# EAGLE design untitled (EAGLE 9.6.2)
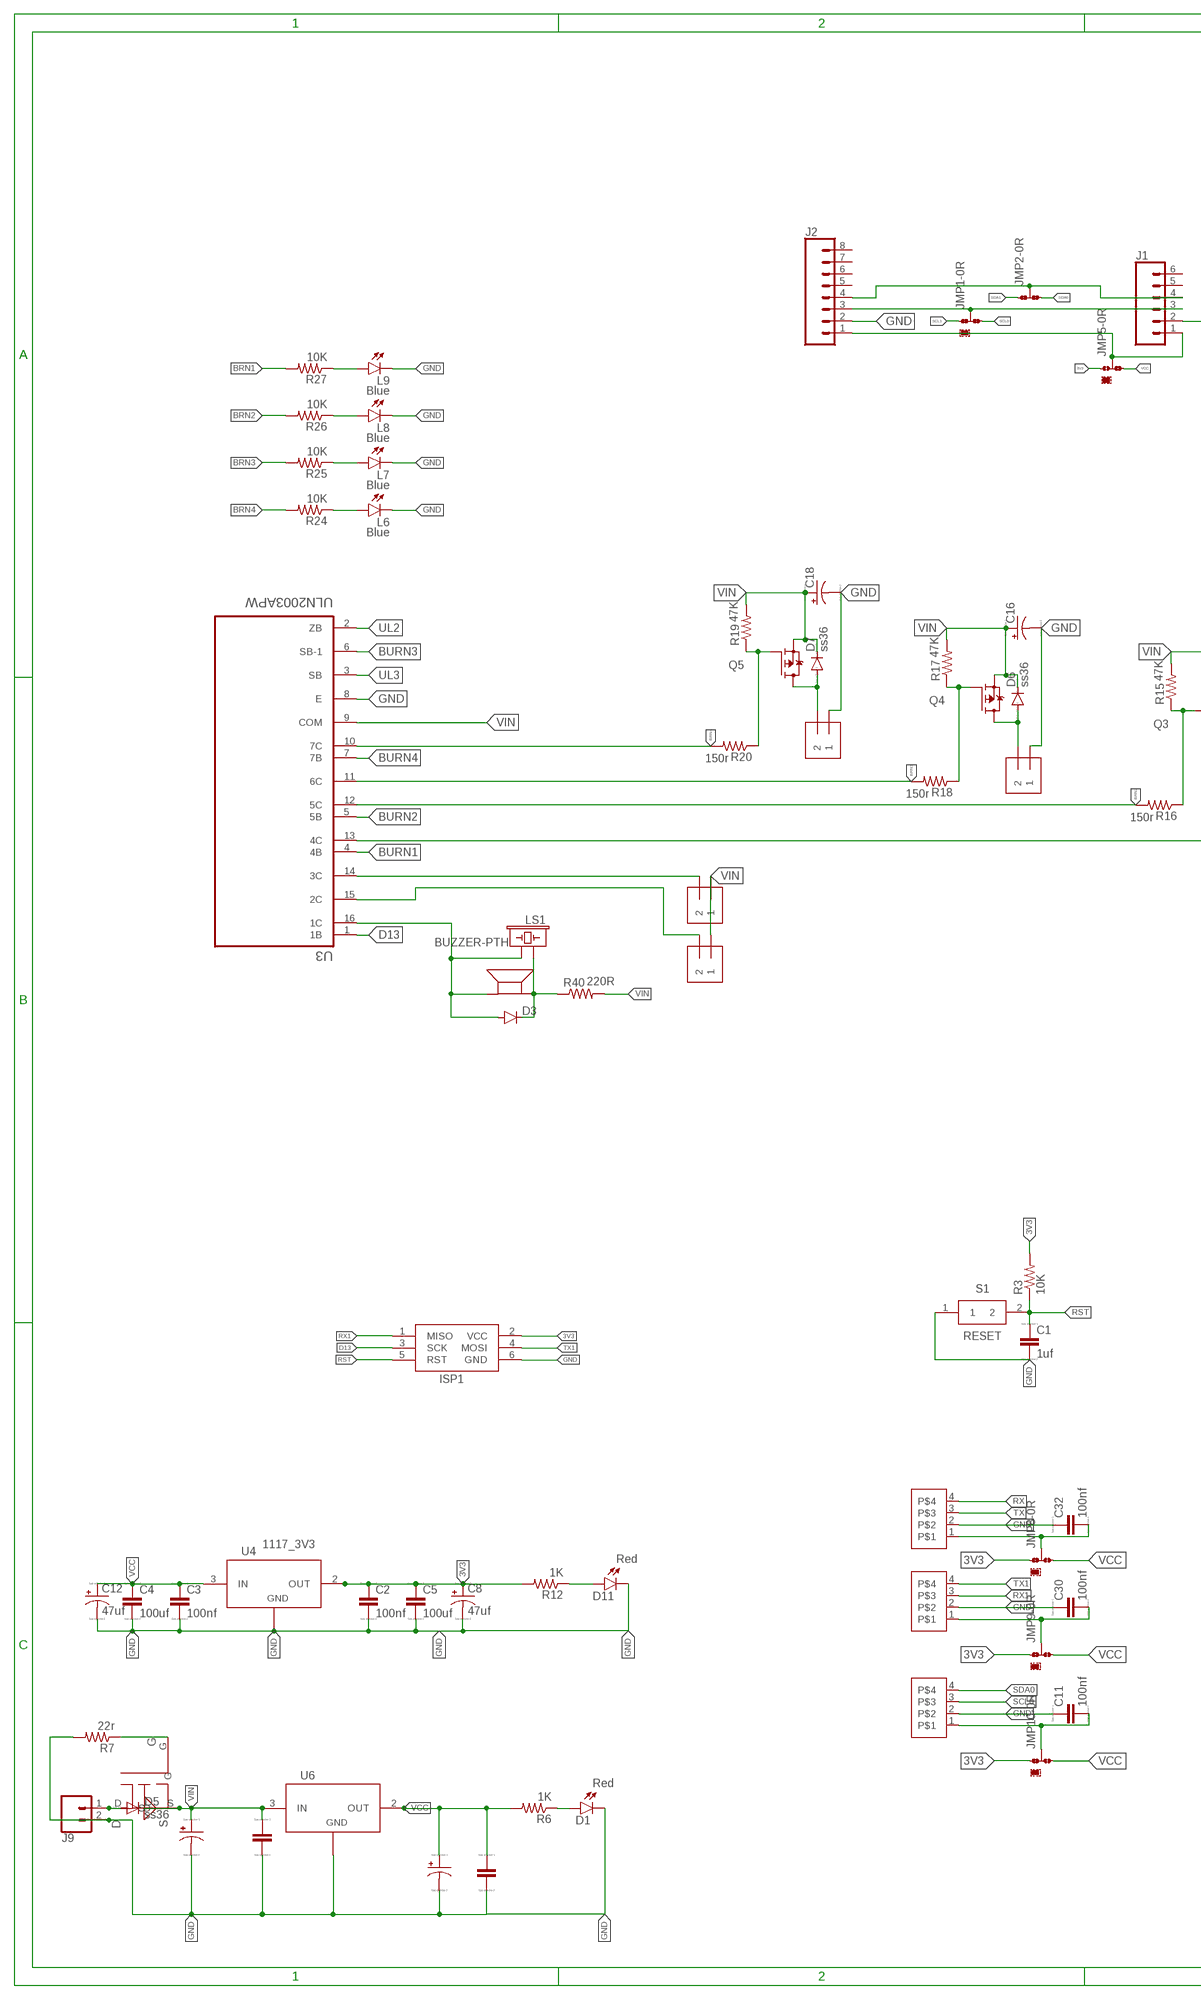
[diagram p0: schematic, sheet 1, part 1 of 2]
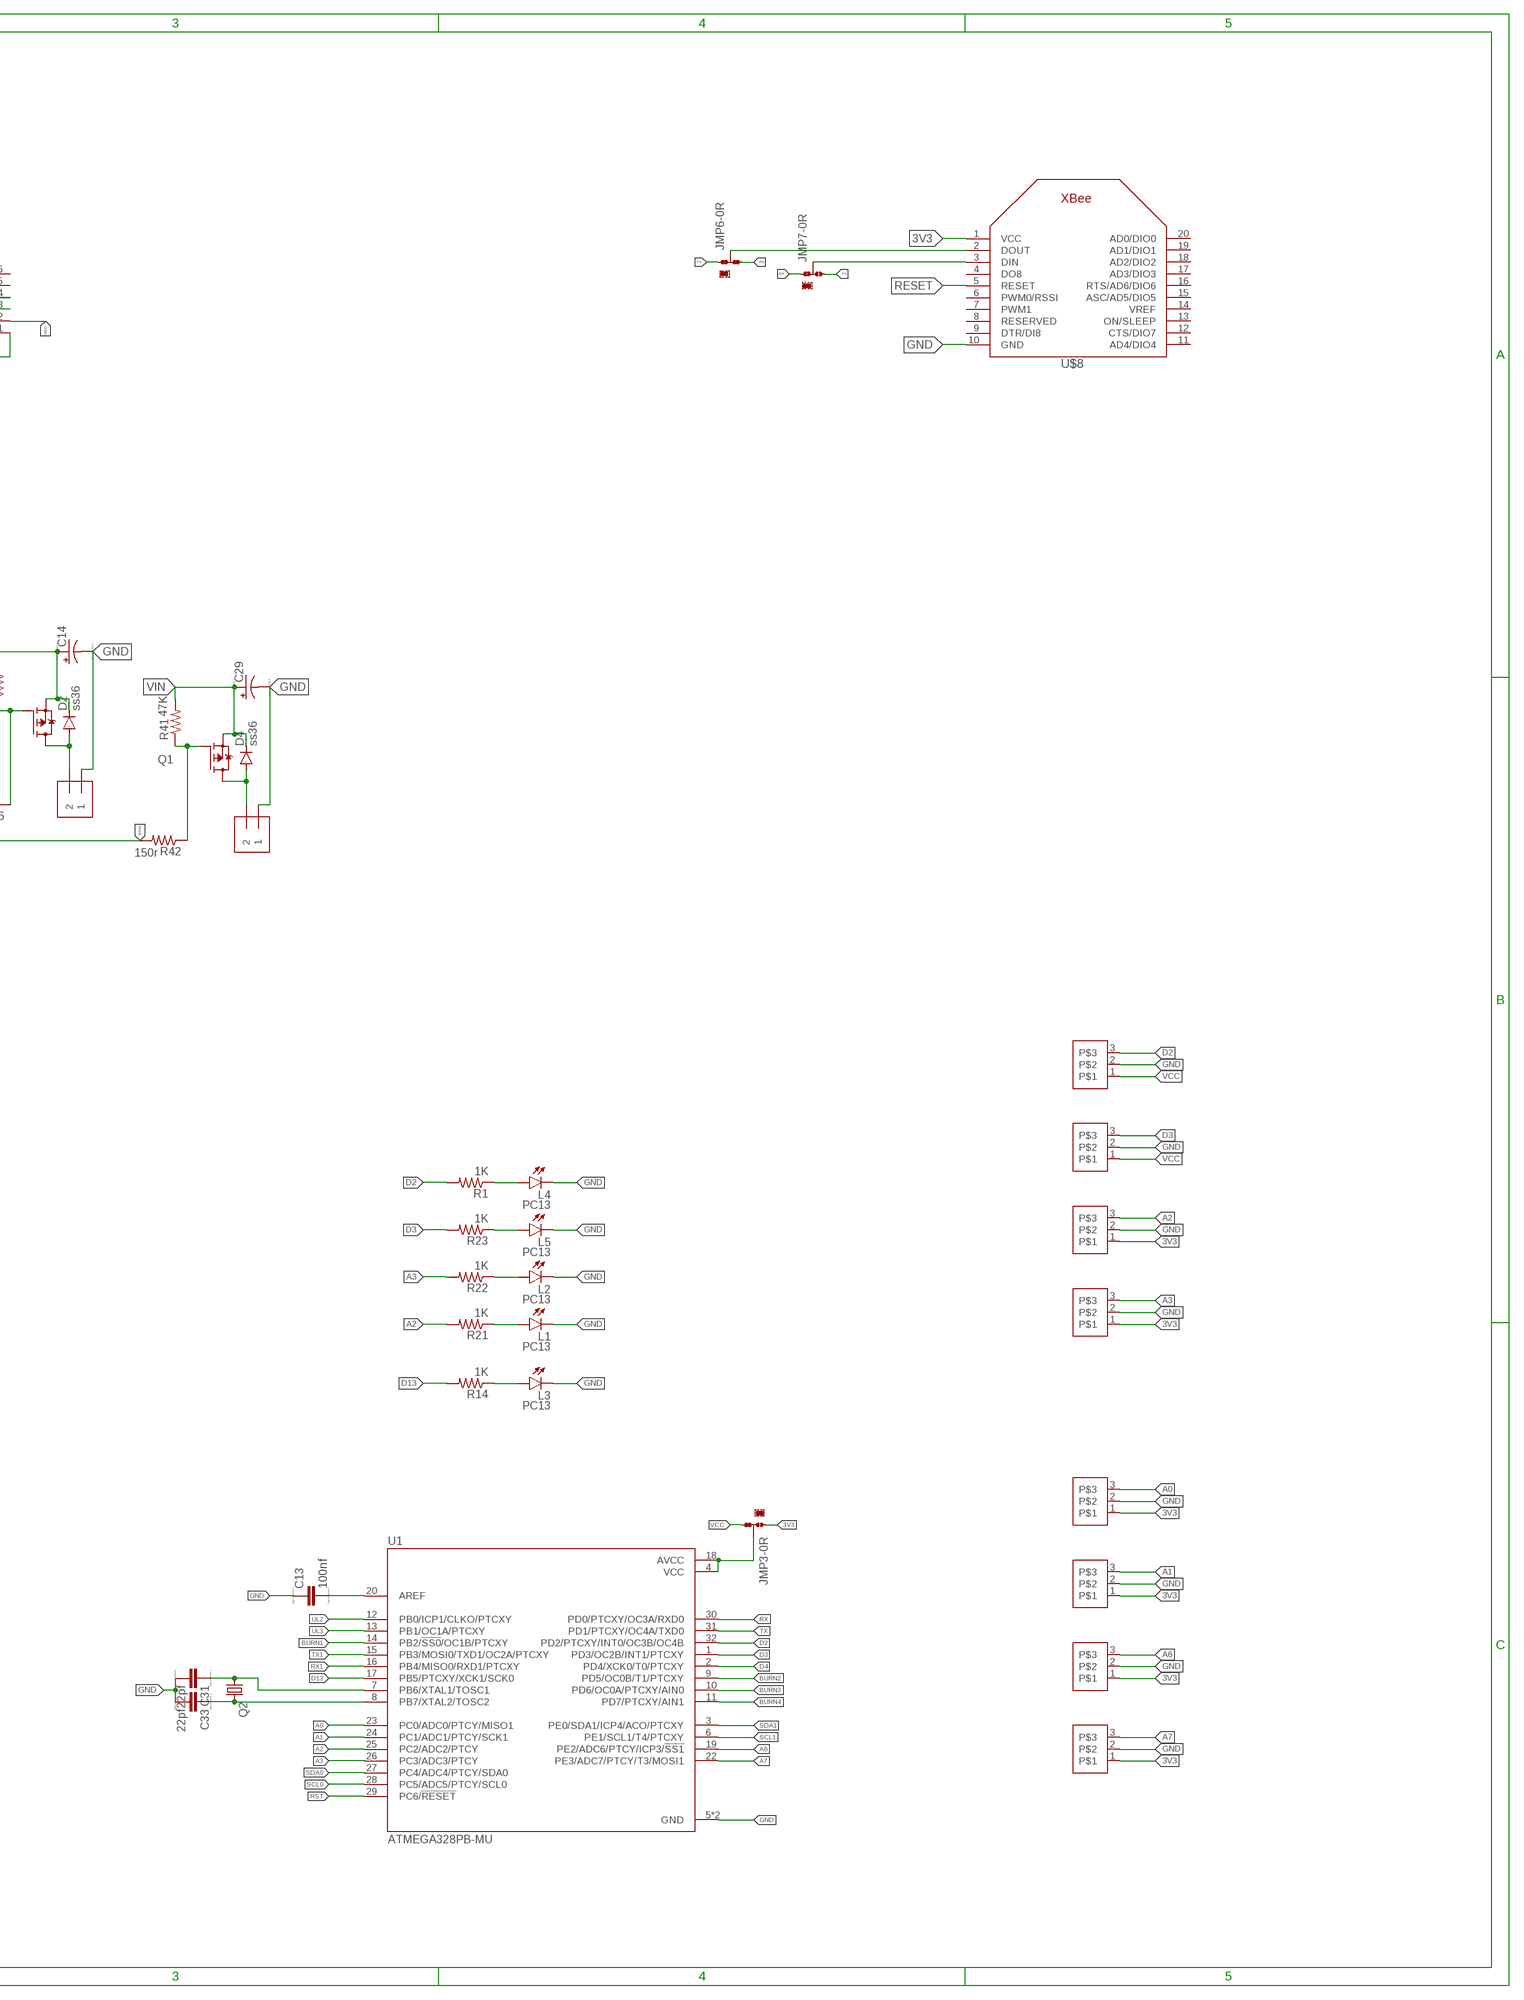
[diagram p1: schematic, sheet 1, part 2 of 2]

## Parts
C1  1uf  CAPACITOR_CER4  [C0603]
C2  100nf  CAPACITOR_CER4  [C0603]
C3  100nf  CAPACITOR_CER4  [C0603]
C4  100uf  CAPACITOR_CER9  [C1210]
C5  100uf  CAPACITOR_CER9  [C1210]
C6  100nf  CAPACITOR_CER4  [C0603]
C7  100uf  CAPACITOR_POLD  [PANASONIC_D]
C8  47uf  CAPACITOR_POLC  [PANASONIC_C]
C9  100nf  CAPACITOR_CER4  [C0603]
C10  100uf  CAPACITOR_POLD  [PANASONIC_D]
C11  100nf  CAPACITOR_CER4  [C0603]
C12  47uf  CAPACITOR_POLC  [PANASONIC_C]
C13  100nf  CAPACITOR_CER4  [C0603]
C14  CAPACITOR_POLC  [PANASONIC_C]
C16  CAPACITOR_POLC  [PANASONIC_C]
C18  CAPACITOR_POLC  [PANASONIC_C]
C29  CAPACITOR_POLC  [PANASONIC_C]
C30  100nf  CAPACITOR_CER4  [C0603]
C31  22pf  CAPACITOR_CER4  [C0603]
C32  100nf  CAPACITOR_CER4  [C0603]
C33  22pf  CAPACITOR_CER4  [C0603]
D1  Red  LED0603_R  [0603_LED_GREEN]
D2  ss36  DIODEAC2  [DO-214AC]
D3  DIODESOD  [SOD-323]
D4  ss36  DIODEAC2  [DO-214AC]
D5  ss36  DIODEAC2  [DO-214AC]
D6  ss36  DIODEAC2  [DO-214AC]
D7  ss36  DIODEAC2  [DO-214AC]
D11  Red  LED0603_R  [0603_LED_GREEN]
ISP1  AVRISP-6  [AVRISP]
J1  CONN_06NO_SILK_NO_POP  [1X06_NO_SILK]
J2  CONN_08NO_SILK_FEMALE_PTH  [1X08_NO_SILK]
J9  CONN_025MM  [SCREWTERMINAL-5MM-2]
JMP1  0R-JUMPA  [A0R-JMP]
JMP2  0R-JUMPA  [A0R-JMP]
JMP3  0R-JUMPA  [A0R-JMP]
JMP5  0R-JUMPA  [A0R-JMP]
JMP6  0R-JUMPA  [A0R-JMP]
JMP7  0R-JUMPA  [A0R-JMP]
JMP8  0R-JUMPA  [A0R-JMP]
JMP9  0R-JUMPA  [A0R-JMP]
JMP10  0R-JUMPA  [A0R-JMP]
L1  PC13  LED0603_R  [0603_LED_GREEN]
L2  PC13  LED0603_R  [0603_LED_GREEN]
L3  PC13  LED0603_R  [0603_LED_GREEN]
L4  PC13  LED0603_R  [0603_LED_GREEN]
L5  PC13  LED0603_R  [0603_LED_GREEN]
L6  Blue  LED0603_R  [0603_LED_GREEN]
L7  Blue  LED0603_R  [0603_LED_GREEN]
L8  Blue  LED0603_R  [0603_LED_GREEN]
L9  Blue  LED0603_R  [0603_LED_GREEN]
LS1  BUZZER-PTH  [BUZZER-12MM]
Q1  FDD4141TO252  [TO252]
Q2  CRYSTALHC49U-V  [HC49U-V]
Q3  FDD4141TO252  [TO252]
Q4  FDD4141TO252  [TO252]
Q5  FDD4141TO252  [TO252]
Q6  AON7401  [DFN-8_3X3]
R1  1K  RESISTOR0603  [R0603]
R3  10K  RESISTOR0603  [R0603]
R6  1K  RESISTOR0603  [R0603]
R7  22r  RESISTOR0603  [R0603]
R12  1K  RESISTOR0603  [R0603]
R14  1K  RESISTOR0603  [R0603]
R15  47K  RESISTOR0603  [R0603]
R16  150r  RESISTOR0603  [R0603]
R17  47K  RESISTOR0603  [R0603]
R18  150r  RESISTOR0603  [R0603]
R19  47K  RESISTOR0603  [R0603]
R20  150r  RESISTOR0603  [R0603]
R21  1K  RESISTOR0603  [R0603]
R22  1K  RESISTOR0603  [R0603]
R23  1K  RESISTOR0603  [R0603]
R24  10K  RESISTOR0603  [R0603]
R25  10K  RESISTOR0603  [R0603]
R26  10K  RESISTOR0603  [R0603]
R27  10K  RESISTOR0603  [R0603]
R40  220R  RESISTOR0603  [R0603]
R41  47K  RESISTOR0603  [R0603]
R42  150r  RESISTOR0603  [R0603]
S1  RESET  SKRKAEE010  [SKRK]
U1  ATMEGA328PB-MU  [QFN50P500X500X90-33N]
U3  ULN2003APW  [SOP65P640X120-16N]
U4  1117_3V3  NCP1117ST33T3G  [SOT-223]
U6  1117_3V3  NCP1117ST33T3G  [SOT-223]
U$1  Z_STOP  FML_1X3  [HDRVR3W64P254_1X3_762X240X800B]
U$2  Y_STOP  FML_1X3  [HDRVR3W64P254_1X3_762X240X800B]
U$3  X_STOP  FML_1X3  [HDRVR3W64P254_1X3_762X240X800B]
U$4  1X2  [1X2]
U$5  1X2  [1X2]
U$6  1X2  [1X2]
U$7  FML_1X4  [HDRVR4W64P254_1X4_1016X240X800B]
U$8  XBEE  [XBEE]
U$9  Z_STOP  FML_1X3  [HDRVR3W64P254_1X3_762X240X800B]
U$10  Z_STOP  FML_1X3  [HDRVR3W64P254_1X3_762X240X800B]
U$11  FML_1X4  [HDRVR4W64P254_1X4_1016X240X800B]
U$12  FML_1X4  [HDRVR4W64P254_1X4_1016X240X800B]
U$13  Z_STOP  FML_1X3  [HDRVR3W64P254_1X3_762X240X800B]
U$14  Y_STOP  FML_1X3  [HDRVR3W64P254_1X3_762X240X800B]
U$15  X_STOP  FML_1X3  [HDRVR3W64P254_1X3_762X240X800B]
U$19  7.5X7.5_BUZZER  [SMD_7.5_BUZZER]
U$20  1X2  [1X2]
U$21  1X2  [1X2]
U$22  1X2  [1X2]

## Nets
3V3: C2.1 C5.1 C8.+ ISP1.2(VCC) JMP3.1 JMP5.1 JMP8.1 JMP9.1 JMP10.1 R3.2 R12.2 U4.2(OUT) U4.4 U$2.1 U$3.1 U$8.1(VCC) U$9.1 U$13.1 U$14.1 U$15.1
A0: U1.23(PC0/ADC0/PTCY/MISO1) U$9.3
A1: U1.24(PC1/ADC1/PTCY/SCK1) U$13.3
A2: R21.2 U1.25(PC2/ADC2/PTCY) U$2.3
A3: R22.2 U1.26(PC3/ADC3/PTCY) U$3.3
A6: U1.19(PE2/ADC6/PTCY/ICP3/!SS1!) U$14.3
A7: U1.22(PE3/ADC7/PTCY/T3/MOSI1) U$15.3
BRN1: R27.2 R42.2 U3.13(4C)
BRN2: R16.2 R26.2 U3.12(5C)
BRN3: R18.2 R25.2 U3.11(6C)
BRN4: R20.2 R24.2 U3.10(7C)
BURN1: U1.14(PB2/!SS0!/OC1B/PTCXY) U3.4(4B)
BURN2: U1.9(PD5/OC0B/T1/PTCXY) U3.5(5B)
BURN3: U1.10(PD6/OC0A/PTCXY/AIN0) U3.6(SB-1)
BURN4: U1.11(PD7/PTCXY/AIN1) U3.7(7B)
D2: R1.2 U1.32(PD2/PTCXY/INT0/OC3B/OC4B) U$10.3
D3: R23.2 U1.1(PD3/OC2B/INT1/PTCXY) U$1.3
D4: U1.2(PD4/XCK0/T0/PTCXY)
D13: ISP1.3(SCK) R14.2 U1.17(PB5/PTCXY/XCK1/SCK0) U3.1(1B)
GND: C1.2 C2.2 C3.2 C4.2 C5.2 C6.2 C7.- C8.- C9.2 C10.- C11.1 C12.- C13.1 C14.- C16.- C18.- C29.- C30.1 C31.2 C32.1 C33.2 D1.C D11.C ISP1.6(GND) J1.2 J2.2 J9.2 L1.C L2.C L3.C L4.C L5.C L6.C L7.C L8.C L9.C R7.2 S1.1 U1.5(GND) U1.21(GND) U3.8(E) U4.1(ADJ/GND) U6.1(ADJ/GND) U$1.2 U$2.2 U$3.2 U$4.P$1 U$5.P$1 U$6.P$1 U$7.2 U$8.10(GND) U$9.2 U$10.2 U$11.2 U$12.2 U$13.2 U$14.2 U$15.2 U$21.P$1
N$2: Q6.G R7.1
N$5: JMP3.2 U1.4(VCC) U1.18(AVCC)
N$7: D1.A R6.1
N$8: D11.A R12.1
N$9: JMP6.2 U$8.2(DOUT)
N$10: JMP7.2 U$8.3(DIN)
N$11: C30.2 JMP9.2 U$12.1
N$12: L3.A R14.1
N$13: D2.A Q3.3(D) U$4.P$2
N$14: Q3.1(G) R15.1 R16.1
N$15: D6.A Q4.3(D) U$5.P$2
N$16: Q4.1(G) R17.1 R18.1
N$17: D7.A Q5.3(D) U$6.P$2
N$18: Q5.1(G) R19.1 R20.1
N$19: C33.1 Q2.2 U1.8(PB7/XTAL2/TOSC2)
N$20: C31.1 Q2.1 U1.7(PB6/XTAL1/TOSC1)
N$21: L1.A R21.1
N$22: L2.A R22.1
N$23: L5.A R23.1
N$24: L6.A R24.1
N$25: L7.A R25.1
N$26: L8.A R26.1
N$27: L9.A R27.1
N$28: C11.2 JMP10.2 U$7.1
N$29: J1.1 J2.1 JMP5.2
N$30: J1.3 J2.3 JMP1.2
N$31: J1.4 J2.4 JMP2.2
N$32: C13.2 U1.20(AREF)
N$33: L4.A R1.1
N$49: C32.2 JMP8.2 U$11.1
N$59: D5.A J9.1 Q6.D
N$71: U3.15(2C) U$20.P$2
N$72: U3.14(3C) U$22.P$2
N$76: D3.A LS1.- U3.16(1C) U$19.-
N$77: D3.C LS1.+ R40.1 U$19.+
N$78: D4.A Q1.3(D) U$21.P$2
N$79: Q1.1(G) R41.1 R42.1
RESET: U$8.5(RESET)
RST: C1.1 ISP1.5(RST) R3.1 S1.2 U1.29(PC6/!RESET!)
RX: JMP6.3 JMP7.1 U1.30(PD0/PTCXY/OC3A/RXD0) U$11.4
RX1: ISP1.1(MISO) U1.16(PB4/MISO0/RXD1/PTCXY) U$12.3
SCL0: JMP1.3 U1.28(PC5/ADC5/PTCY/SCL0) U$7.3
SCL1: JMP1.1 U1.6(PE1/SCL1/T4/PTCXY)
SDA0: JMP2.3 U1.27(PC4/ADC4/PTCY/SDA0) U$7.4
SDA1: JMP2.1 U1.3(PE0/SDA1/ICP4/ACO/PTCXY)
TX: JMP6.1 JMP7.3 U1.31(PD1/PTCXY/OC4A/TXD0) U$11.3
TX1: ISP1.4(MOSI) U1.15(PB3/MOSI0/TXD1/OC2A/PTCXY) U$12.4
UL2: U1.12(PB0/ICP1/CLKO/PTCXY) U3.2(ZB)
UL3: U1.13(PB1/OC1A/PTCXY) U3.3(SB)
VCC: C3.1 C4.1 C6.1 C7.+ C12.+ JMP3.3 JMP5.3 JMP8.3 JMP9.3 JMP10.3 R6.2 U4.3(IN) U6.2(OUT) U6.4 U$1.1 U$10.1
VIN: C9.1 C10.+ C14.+ C16.+ C18.+ C29.+ D2.C D4.C D5.C D6.C D7.C Q1.2(S) Q3.2(S) Q4.2(S) Q5.2(S) Q6.S R15.2 R17.2 R19.2 R40.2 R41.2 U3.9(COM) U6.3(IN) U$20.P$1 U$22.P$1
Unconnected: J1.5 J1.6 J2.5 J2.6 J2.7 J2.8 U$8.4(DO8) U$8.6(PWM0/RSSI) U$8.7(PWM1) U$8.8(RESERVED) U$8.9(DTR/DI8) U$8.11(AD4/DIO4) U$8.12(CTS/DIO7) U$8.13(ON/SLEEP) U$8.14(VREF) U$8.15(ASC/AD5/DIO5) U$8.16(RTS/AD6/DIO6) U$8.17(AD3/DIO3) U$8.18(AD2/DIO2) U$8.19(AD1/DIO1) U$8.20(AD0/DIO0)

## Library data of the parts
C1-C6 C9 C11 C13 C30-C33 = pasif_com1:CAPACITOR_CER
C7 C8 C10 C12 C14 C16 C18 C29 = pasif_com1:CAPACITOR_POL
D1 D11 L1-L9 = pasif_com1:LED
D2 D4-D7 = pasif_com1:DIODE
D3 = BeagleBone_Blue_R3:DIODE: Diode These are standard reverse protection diodes and small signal diodes. SMA package can handle up to about 1A. SOD-323 can handle about 200mA. What the SOD-323 package when ordering, there are some mfgs out there that are 5-pin packages.; PROD_ID: DIO-09646
ISP1 = adafruit:AVRISP: AVR ISP HEADER Standard 6 pin header for AVR programming
J1 = SparkFun-Connectors:CONN_06: Multi connection point. Often used as Generic Header-pin footprint for 0.1 inch spaced/style header connections On any of the 0.1 inch spaced packages, you can populate with these: Break Away Headers - Straight <https://www.sparkfun.com/products/116> (PRT-00116) Break Away Male Headers - Right Angle <https://www.sparkfun.com/products/553> (PRT-00553) Female Headers <https://www.sparkfun.com/products/115> (PRT-00115) Break Away Headers - Machine Pin <https://www.sparkfun.com/products/117> (PRT-00117) Break Away Female Headers - Swiss Machine Pin <https://www.sparkfun.com/products/743> (PRT-00743) Arduino Stackable Header - 6 Pin <https://www.sparkfun.com/products/9280> (PRT-09280) For SCREWTERMINALS and SPRING TERMINALS visit here: Screw Terimnals on SparkFun.com <https://www.sparkfun.com/search/results?term=Screw+Terminals> (5mm/3.5mm/2.54mm spacing) This device is also useful as a general connection point to wire up your design to another part of your project. Our various solder wires solder well into these plated through hole pads. Hook-Up Wire - Assortment (Stranded, 22 AWG) <https://www.sparkfun.com/products/11375> (PRT-11375) Hook-Up Wire - Assortment (Solid Core, 22 AWG) <https://www.sparkfun.com/products/11367> (PRT-11367) View the entire wire category on our website here <https://www.sparkfun.com/categories/141>
J2 = SparkFun-Connectors:CONN_08: Multi connection point. Often used as Generic Header-pin footprint for 0.1 inch spaced/style header connections On any of the 0.1 inch spaced packages, you can populate with these: Break Away Headers - Straight <https://www.sparkfun.com/products/116> (PRT-00116) Break Away Male Headers - Right Angle <https://www.sparkfun.com/products/553> (PRT-00553) Female Headers <https://www.sparkfun.com/products/115> (PRT-00115) Break Away Headers - Machine Pin <https://www.sparkfun.com/products/117> (PRT-00117) Break Away Female Headers - Swiss Machine Pin <https://www.sparkfun.com/products/743> (PRT-00743) Arduino Stackable Header - 8 Pin <https://www.sparkfun.com/products/9279> (PRT-09279) For SCREWTERMINALS and SPRING TERMINALS visit here: Screw Terimnals on SparkFun.com <https://www.sparkfun.com/search/results?term=Screw+Terminals> (5mm/3.5mm/2.54mm spacing) This device is also useful as a general connection point to wire up your design to another part of your project. Our various solder wires solder well into these plated through hole pads. Hook-Up Wire - Assortment (Stranded, 22 AWG) <https://www.sparkfun.com/products/11375> (PRT-11375) Hook-Up Wire - Assortment (Solid Core, 22 AWG) <https://www.sparkfun.com/products/11367> (PRT-11367) View the entire wire category on our website here <https://www.sparkfun.com/categories/141> Special notes: Molex polarized connector foot print use with SKU : PRT-08231 with associated crimp pins and housings. 1MM SMD Version SKU: PRT-10208 NOTES ON THE VARIANTS LOCK and LOCK_LONGPADS... This footprint was designed to help hold the alignment of a through-hole component (i.e. 6-pin header) while soldering it into place. You may notice that each hole has been shifted either up or down by 0.005 of an inch from it's more standard position (which is a perfectly straight line). This slight alteration caused the pins (the squares in the middle) to touch the edges of the holes. Because they are alternating, it causes a "brace" to hold the component in place. 0.005 has proven to be the perfect amount of "off-center" position when using our standard breakaway headers. Although looks a little odd when you look at the bare footprint, once you have a header in there, the alteration is very hard to notice. Also,if you push a header all the way into place, it is covered up entirely on the bottom side.; PROD_ID: CONN-08438
J9 = SparkFun-Connectors:CONN_02: Multi connection point. Often used as Generic Header-pin footprint for 0.1 inch spaced/style header connections On any of the 0.1 inch spaced packages, you can populate with these: Break Away Headers - Straight <https://www.sparkfun.com/products/116> (PRT-00116) Break Away Male Headers - Right Angle <https://www.sparkfun.com/products/553> (PRT-00553) Female Headers <https://www.sparkfun.com/products/115> (PRT-00115) Break Away Headers - Machine Pin <https://www.sparkfun.com/products/117> (PRT-00117) Break Away Female Headers - Swiss Machine Pin <https://www.sparkfun.com/products/743> (PRT-00743) For SCREWTERMINALS and SPRING TERMINALS visit here: Screw Terimnals on SparkFun.com <https://www.sparkfun.com/search/results?term=Screw+Terminals> (5mm/3.5mm/2.54mm spacing) This device is also useful as a general connection point to wire up your design to another part of your project. Our various solder wires solder well into these plated through hole pads. Hook-Up Wire - Assortment (Stranded, 22 AWG) <https://www.sparkfun.com/products/11375> (PRT-11375) Hook-Up Wire - Assortment (Solid Core, 22 AWG) <https://www.sparkfun.com/products/11367> (PRT-11367) View the entire wire category on our website here <https://www.sparkfun.com/categories/141> Special notes: Molex polarized connector foot print use with: PRT-08233 with associated crimp pins and housings. 2.54_SCREWTERM for use with PRT-10571. 3.5mm Screw Terminal footprints for PRT-08084 5mm Screw Terminal footprints for use with PRT-08432; SF_SKU: PRT-08432
JMP1-JMP3 JMP5-JMP10 = jump-0r-smd:0R-JUMP: SMD 0R 0805 Jumper
LS1 = SparkFun-Electromechanical:BUZZER: Buzzer Small round buzzers that operate around the audible 2kHz range. You can use these as speakers to create simple music or user interfaces. Variant Overview: PTH - Mini Speaker - PC Mount 12mm 2.048kHz <https://www.sparkfun.com/products/7950> PTH_KIT - Mini Speaker - PC Mount 12mm 2.048kHz <https://www.sparkfun.com/products/7950> KIT simplifies soldering by adding stop mask to one side of the pads. PTH_NO_SILK - Mini Speaker - PC Mount 12mm 2.048kHz <https://www.sparkfun.com/products/7950> No silkscreen indicator of buzzer outline. PTH_KIT_NO_SILK - Mini Speaker - PC Mount 12mm 2.048kHz <https://www.sparkfun.com/products/7950> KIT package w/o silkscreen SMD - Buzzer Audio Magnetic (CCV-084B16) SMD buzzer used on, e.g. the LilyPad Buzzer <https://www.sparkfun.com/products/8463> and RFID USB Reader <https://www.sparkfun.com/products/9963>. SMD_KIT - Buzzer Audio Magnetic (CCV-084B16) SMD Buzzer with elongated pins to make soldering easier. Used on the SparkFun Simon Says - Surface Mount Soldering Kit <https://www.sparkfun.com/products/10935>.; PROD_ID: COMP-08253; SF_SKU: COM-07950
Q1 Q3-Q5 = transistor-fet:FDD4141: P-Channel PowerTrench® MOSFET Source: FDD4141.pdf
Q2 = crystal:CRYSTAL: CRYSTAL; OC_FARNELL: 1666969; OC_NEWARK: unknown
Q6 = AON7401:AON7401
R1 R3 R6 R7 R12 R14-R27 R40-R42 = pasif_com1:RESISTOR
S1 = SKRKAEE010:SKRKAEE010: Tactile Switches 3.9x2.9x2.0mm 160gf Packaging Temp 60oC <https://componentsearchengine.com/Images/1/SKRKAEE010.jpg> Source: Datasheet <http://www.mouser.com/ds/2/15/SKRK-1110686.pdf>; AVAILABILITY: Unavailable; DESCRIPTION: Switch Tactile N.O. SPST Round Button Gull Wing 0.05A 12VDC 1.57N SMD T/R; MF: ALPS; MP: SKRKAEE010; PACKAGE: None; PRICE: None
U1 = ATMEGA328PB-MU:ATMEGA328PB-MU: AVR 32KBytes Flash, 1KBytes EEPROM, 2KBytes RAM, w - 20MHZ, QFN/MFL, IND TEMP, GREEN 5 V/ DFN/QFN (M); AVAILABILITY: Unavailable; DESCRIPTION: AVR 32KBytes Flash, 1KBytes EEPROM, 2KBytes RAM, w - 20MHZ, QFN/MFL, IND TEMP, GREEN 5 V/ DFN/QFN _M_; MF: Microchip; MP: ATMEGA328PB-MU; PACKAGE: VFQFN-32 Microchip; PRICE: None
U3 = ULN2003APW:ULN2003APW: Check prices <https://pricing.snapeda.com/parts/ULN2003APW/Texas%20Instruments/view-part?ref=eda>; AVAILABILITY: Good; DESCRIPTION: 50-V, 7-ch darlington transistor array, -20C to 70C 16-TSSOP -40 to 70; MF: Texas Instruments; MP: ULN2003APW; PACKAGE: TSSOP-16 Texas Instruments; PRICE: None; PURCHASE-URL: https://pricing.snapeda.com/search/part/ULN2003APW/?ref=eda
U4 U6 = IC:NCP1117ST33T3G: IC REG LINEAR 3.3V 1A SOT223 Manufacturer's datasheet <https://www.onsemi.com/pub/Collateral/NCP1117-D.PDF>; CREATED_BY: PCBLayout.com; DIGIKEY_PART_NUMBER: NCP1117ST33T3GOSTR-ND; MANUFACTURER: ON Semiconductor; MPN: NCP1117ST33T3G; PACKAGE: SOT-223
U$1-U$3 U$9 U$10 U$13-U$15 = header_3d:FML_1X3
U$4-U$6 U$20-U$22 = header_3d:1X2
U$7 U$11 U$12 = header_3d:FML_1X4
U$8 = adafruit:XBEE
U$19 = buzzer_smd_no_drill:7.5X7.5_BUZZER

## Board
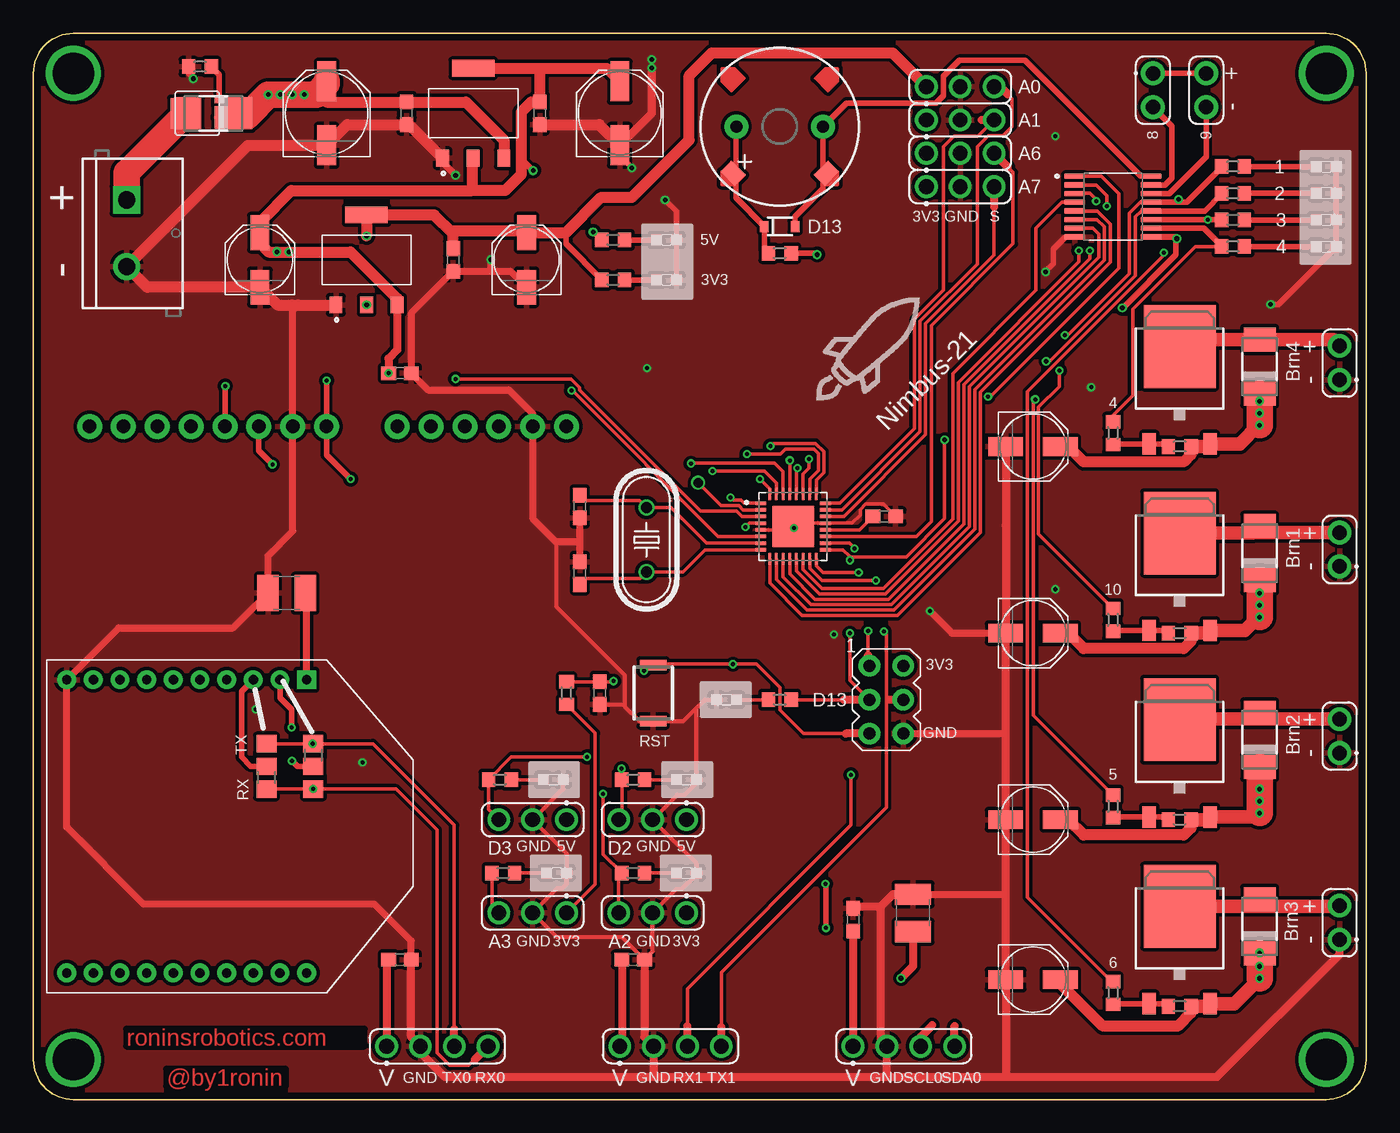
[diagram p2: board, top side]
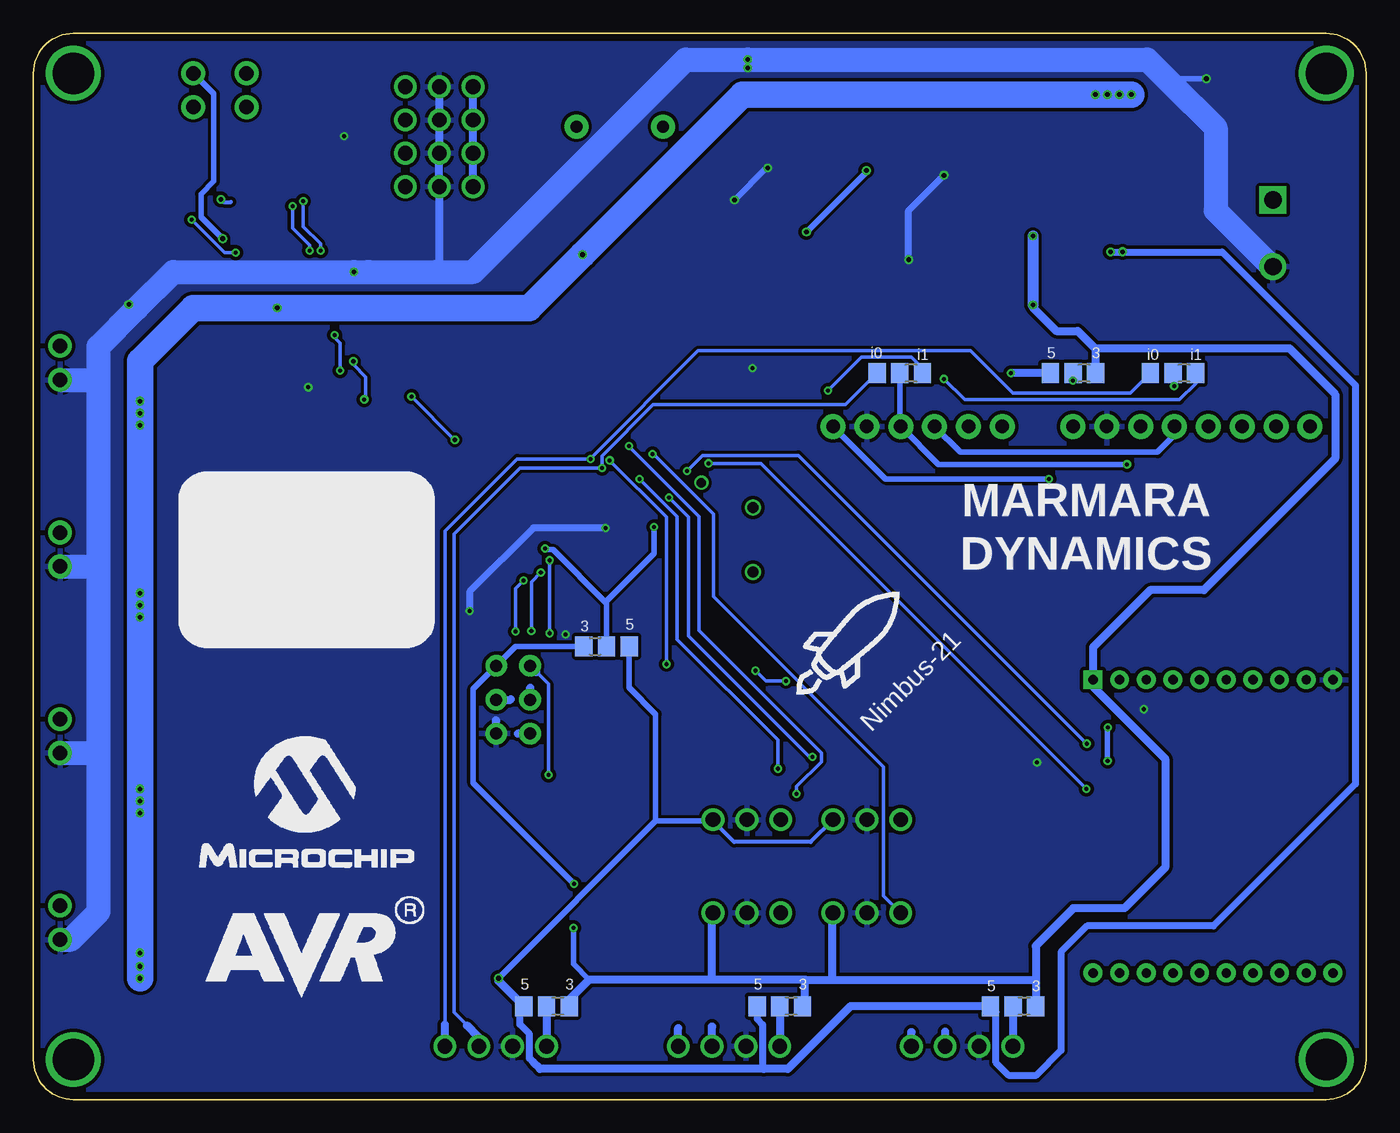
[diagram p3: board, bottom side, seen from below]

Size 100 x 80 mm. Coordinates in mm from the lower left corner, seen from the top.
Outline: 0,3 arc90 3,0 97,0 arc90 100,3 100,77 arc90 97,80 3,80 arc90 0,77 0,3
Copper layers (1*16): Top 0.035mm / dielectric 1.6mm / Bottom 0.035mm
Design rules "Elecrow_2-layer_PCB_eagle_rule": minimum track width 6mil, minimum drill 12mil, track to track 6mil, track to pad 6mil, pad to pad 6mil, via to via 8mil, smd to smd 0mil, copper to edge 20mil, drill to drill 10mil, minimum pad ring 6mil, minimum via ring 6mil, stop-mask expansion 0mil, vias tented up to drill 100mil, thermal gap 10mil

### Footprints (pad centres in the part's own frame; a part is rotated, then mirrored left to right if it is on the bottom)
C0603 = smd 1.1 x 1: 1 -0.85,0; 2 0.85,0
C1210 = smd 1.6 x 2.7: 1 -1.4,0; 2 1.4,0
PANASONIC_D = smd 3 x 1.4: + 2.4,0; - -2.4,0
PANASONIC_C = smd 2.6 x 1.4: + 2.05,0; - -2.05,0
0603_LED_GREEN = smd 0.8 x 0.8: A 0,-0.75; C 0,0.75
DO-214AC = smd 1.8 x 2.4: A 2.025,0; C -2.025,0
SOD-323 = smd 0.63 x 0.83: A 1.15,0; C -1.15,0
AVRISP = drill 0.9 pad 1.626: 1 -1.27,2.54; 2 1.27,2.54; 3 -1.27,0; 4 1.27,0; 5 -1.27,-2.54; 6 1.27,-2.54
1X06_NO_SILK = drill 1.016 pad 1.88: 1 0,0; 2 2.54,0; 3 5.08,0; 4 7.62,0; 5 10.16,0; 6 12.7,0
1X08_NO_SILK = drill 1.016 pad 1.88: 1 0,0; 2 2.54,0; 3 5.08,0; 4 7.62,0; 5 10.16,0; 6 12.7,0; 7 15.24,0; 8 17.78,0
SCREWTERMINAL-5MM-2 = drill 1.3 pad 2.032 square: 1 0,0 | drill 1.3 pad 2.032: 2 5,0
A0R-JMP = smd 1.5 x 1.3: 1 0,1.7; 2 0,0; 3 0,-1.7
BUZZER-12MM = drill 0.9 pad 1.778: + 3.25,0; - -3.25,0
TO252 = smd 1 x 1.6: 1 -2.28,-4.8; 2 2.28,-4.8 | smd 5.4 x 6.2: 3 0,2.5
HC49U-V = drill 0.813: 1 -2.413,0; 2 2.413,0
DFN-8_3X3 = smd 2.29 x 2.29: D 0,0.8 | smd 0.4 x 0.7: G 0.96,-1.7 | smd 1.7 x 0.7: S -0.3,-1.7
R0603 = smd 1 x 1.1: 1 -0.85,0; 2 0.85,0
SKRK = smd 0.8 x 2: 1 -2.1,0; 2 2.1,0
QFN50P500X500X90-33N = smd 0.86 x 0.26: 1 -2.435,1.75; 2 -2.435,1.25; 3 -2.435,0.75; 4 -2.435,0.25; 5 -2.435,-0.25; 6 -2.435,-0.75; 7 -2.435,-1.25; 8 -2.435,-1.75; 17 2.435,-1.75; 18 2.435,-1.25; 19 2.435,-0.75; 20 2.435,-0.25; 21 2.435,0.25; 22 2.435,0.75; 23 2.435,1.25; 24 2.435,1.75 | smd 0.26 x 0.86: 9 -1.75,-2.435; 10 -1.25,-2.435; 11 -0.75,-2.435; 12 -0.25,-2.435; 13 0.25,-2.435; 14 0.75,-2.435; 15 1.25,-2.435; 16 1.75,-2.435; 25 1.75,2.435; 26 1.25,2.435; 27 0.75,2.435; 28 0.25,2.435; 29 -0.25,2.435; 30 -0.75,2.435; 31 -1.25,2.435; 32 -1.75,2.435 | smd 3.1 x 3.1: 33 0,0
SOP65P640X120-16N = smd 1.57 x 0.41: 1 -2.87,2.275; 2 -2.87,1.625; 3 -2.87,0.975; 4 -2.87,0.325; 5 -2.87,-0.325; 6 -2.87,-0.975; 7 -2.87,-1.625; 8 -2.87,-2.275; 9 2.87,-2.275; 10 2.87,-1.625; 11 2.87,-0.975; 12 2.87,-0.325; 13 2.87,0.325; 14 2.87,0.975; 15 2.87,1.625; 16 2.87,2.275
SOT-223 = smd 0.96 x 1.26: 1 -2.3,-3.375; 2 0,-3.375; 3 2.3,-3.375 | smd 3.19 x 1.26: 4 0,3.375
HDRVR3W64P254_1X3_762X240X800B = drill 1.105 pad 1.705: 1 0,0; 2 2.54,0; 3 5.08,0
1X2 = drill 1.092 pad 1.778: P$1 0,0; P$2 2.54,0
HDRVR4W64P254_1X4_1016X240X800B = drill 1.105 pad 1.705: 1 0,0; 2 2.54,0; 3 5.08,0; 4 7.62,0
XBEE = drill 0.7 pad 1.422 square: 1 -11,5.5 | drill 0.7 pad 1.422: 2 -11,3.5; 3 -11,1.5; 4 -11,-0.5; 5 -11,-2.5; 6 -11,-4.5; 7 -11,-6.5; 8 -11,-8.5; 9 -11,-10.5; 10 -11,-12.5; 11 11,-12.5; 12 11,-10.5; 13 11,-8.5; 14 11,-6.5; 15 11,-4.5; 16 11,-2.5; 17 11,-0.5; 18 11,1.5; 19 11,3.5; 20 11,5.5
SMD_7.5_BUZZER = smd 1.55 x 1.2 rotated 45: + -3.5,3.5 | smd 1.55 x 1.2 rotated 135: - -3.5,-3.5

### Placement (x,y rotation side)
C1  42.5,30.5 270 top
C2  31.5,63 270 top
C3  38,74 270 top
C4  66,14 90 top
C5  19,38 180 top
C6  27.5,54.5 0 top
C7  44,74 90 top
C8  37,63 90 top
C9  28,74 270 top
C10  22,74 90 top
C11  61.5,13.5 270 top
C12  17,63 90 top
C13  63.85,43.75 180 top
C14  75,21 0 top
C16  75,9 0 top
C18  75,49 0 top
C29  75,35 0 top
C30  45,10.5 180 top
C31  41,44.5 270 top
C32  27.5,10.5 180 top
C33  41,39.5 90 top
D1  47.5,64.5 270 top
D2  92,27 90 top
D3  56,65.5 0 top
D4  92,41 90 top
D5  13.5,74 180 top
D6  92,13 90 top
D7  92,55 90 top
D11  47.5,61.5 270 top
ISP1  64,30 0 top
J1  40,50.5 180 top
J2  22,50.5 180 top
J9  7,67.5 270 top
JMP1  35,54.5 270 bottom
JMP2  14.5,54.5 270 bottom
JMP3  57,34 90 bottom
JMP5  22,54.5 270 bottom
JMP6  21,25 0 top
JMP7  17.5,25 180 top
JMP8  26.5,7 270 bottom
JMP9  44,7 270 bottom
JMP10  61.5,7 270 bottom
L1  49,17 270 top
L2  39.25,17 270 top
L3  52,30 90 top
L4  49,24 270 top
L5  39,24 270 top
L6  97,64 270 top
L7  97,66 270 top
L8  97,68 270 top
L9  97,70 270 top
LS1  56,73 180 top
Q1  86,40 0 top
Q2  46,42 270 top
Q3  86,26 0 top
Q4  86,12 0 top
Q5  86,54 0 top
Q6  12.25,74 90 top
R1  45,24 180 top
R3  40,30.5 270 top
R6  43.5,64.5 180 top
R7  12.5,77.5 180 top
R12  43.5,61.5 180 top
R14  56,30 0 top
R15  86,21 0 top
R16  81,22 90 top
R17  86,7 0 top
R18  81,8 90 top
R19  86,49 0 top
R20  81,50 90 top
R21  45,17 180 top
R22  35.25,17 180 top
R23  35,24 180 top
R24  90,64 180 top
R25  90,66 180 top
R26  90,68 180 top
R27  90,70 180 top
R40  56,63.5 0 top
R41  86,35 0 top
R42  81,36 90 top
S1  46.5,30.5 90 top
U1  57,43 0 top
U3  81,67 0 top
U4  25,63 0 top
U6  33,74 0 top
U$1  40,21 180 top
U$2  49,14 180 top
U$3  40,14 180 top
U$4  98,26 90 top
U$5  98,12 90 top
U$6  98,54 90 top
U$7  61.5,4 0 top
U$8  15,20.5 270 top
U$9  67,76 0 top
U$10  49,21 180 top
U$11  26.5,4 0 top
U$12  44,4 0 top
U$13  67,73.5 0 top
U$14  67,71 0 top
U$15  67,68.5 0 top
U$19  56,73 90 top
U$20  84,77 270 top
U$21  98,40 90 top
U$22  88,77 270 top

### Tracks (layer width: path | path; a pad name or v marks a point on that pad's centre or on a via)
3V3  (via drill 0.3, 0.35)
  Top 0.254: U$3.1 42.15,16.14 42.15,27.5 R3.2
  Top 0.406: R12.2 39.95,64.2 39.95,65.05 | v59.47,12.87 59.47,16.13 v59.42,16.17
  Top 0.508: U$8.1 20.5,37.9 C5.1
  Top 0.813: U$9.1 64.47,78.53 50.9,78.53 49.2,76.83 49.2,72 44.9,67.7 42.6,67.7 39.95,65.05 C8.+ 36.9,65.15 31.5,65.15 C2.1 31.5,64.95 30.07,66.38 U4.4 v25,64.8
  Bottom 0.305: 59.5,7.3 JMP10.1
  Bottom 0.406: JMP3.1 63.81,34 ISP1.2 66.99,30.82 66.99,23.74 v59.42,16.17 | 58.3,9 59.47,10.17 v59.47,12.87
  Bottom 0.61: 24.8,9 JMP8.1 | 42.1,9 40.04,9 | 40.04,9 24.8,9 | 42.1,9 49.08,9 | 49.08,9 58.3,9 59.8,7.5 JMP10.1 | JMP9.1 42.1,7.2 42.1,9 | U$15.1 U$14.1 U$13.1 U$9.1 | U4.2 25,59.4 23.26,57.66 21.65,57.66 20.3,56.31 | JMP5.1 20.3,56.31 | 20.3,56.31 20.25,56.37 5.76,56.37 2.32,52.92 2.32,48.08 12.17,38.23 16.2,38.23 20.5,33.93 U$8.1 20.5,30.98 15.08,25.56 15.08,17.4 18.14,14.35 21.97,14.35 24.8,11.52 24.8,9 | 40.04,9 40.04,13.96 U$3.1 | 49.08,9 49.08,13.92 U$2.1
  Bottom 0.813: v25,64.8 U4.2
  other vias: 25,59.62
A0
  Top 0.254: U1.23 60.66,44.25 66.53,50.12 66.53,58.39 70.82,62.69 70.82,71.49 71.64,72.31 72.75,72.31 73.44,73 73.44,75.11 73.14,75.4
  Top 0.61: U$9.3 72.55,76 73.14,75.4
A1
  Top 0.254: U1.24 60.52,44.75 66.12,50.35 66.12,58.56 68.29,60.73 68.29,71.48 69.08,72.27 70.85,72.27 U$13.3
  Top 0.61: U$13.3 71.14,73.5
A2  (via drill 0.3)
  Top 0.254: U$2.3 43.92,16.77 R21.2 42.75,18.4 v42.75,22.92 | U1.25 58.75,46.48 59.3,47.03 59.3,48.62 58.69,49.23 55.51,49.23 v55.3,49.03
  Bottom 0.254: v55.3,49.03 55.3,48.99 50.07,43.76 50.07,35.19 40.88,26 40.88,25.34 42.75,23.48 v42.75,22.92
A3  (via drill 0.3)
  Top 0.254: U$3.3 34.42,14.5 34.42,16.36 34.4,16.38 R22.2 | U1.26 58.25,46.55 58.9,47.2 58.9,48.46 58.55,48.8 56.43,48.8 56.05,48.43 53.55,48.43 v53.54,48.44
  Bottom 0.254: v53.54,48.44 53.48,48.44 48.98,43.94 48.98,37.75 36.2,24.98 36.2,15.28 U$3.3
A6
  Top 0.254: U1.19 66.26,42.25 67.38,43.37 67.38,58.07 73.51,64.2 73.51,69.57 73.09,69.99
  Top 0.61: U$14.3 73.09,69.99
A7
  Top 0.254: U1.22 60.8,43.75 66.94,49.88 66.94,58.22 72.08,63.37 72.08,66.97
  Top 0.61: U$15.3 72.08,66.97
BRN1  (via drill 0.3, 0.35)
  Top 0.254: U3.13 83.06,67.33 82.23,66.5 82.23,61.98 77.6,57.35 v77.39,57.35 | R42.2 75.42,42.43 75.42,51.96 76.97,53.51 v76.97,54.69
  Top 0.305: v85.93,67.53 85.72,67.33 U3.13
  Top 0.406: R27.2 89.15,69.95 86.53,67.33 U3.13
  Bottom 0.254: v76.97,54.69 76.97,56.74 77.39,57.15 v77.39,57.35
  Bottom 0.305: v85.93,67.53 85.73,67.33 85.17,67.33
BRN2  (via drill 0.3)
  Top 0.254: U3.12 83.14,66.67 82.7,66.24 82.7,61.83 76.23,55.37 76.01,55.37 v75.99,55.39 | R16.2 75.01,28.84 75.01,52.46 75.08,52.53 v75.17,52.53
  Top 0.406: R26.2 89.15,67.95 87.88,66.67 U3.12
  Bottom 0.254: v75.17,52.53 75.07,52.63 75.07,54.21 75.99,55.13 v75.99,55.39
BRN3  (via drill 0.3)
  Top 0.254: 88.05,66.03 88.11,66.03 v88.12,66.02 | v84.81,63.54 84.81,63.36 74.58,53.13 74.58,15.18 80.91,8.85 R18.2
  Top 0.406: R25.2 89.12,66.03 88.05,66.03 U3.11
  Bottom 0.254: v88.12,66.02 85.64,63.54 v84.81,63.54
BRN4
  Top 0.254: R20.2 81,51.32 82.49,52.81 82.49,59.3 87.19,64 89.2,64
  Top 0.406: R24.2 89.15,64.05 | 89.2,64 89.15,64.05 | 89.15,64.05 87.83,65.38 U3.10
BURN1
  Top 0.254: U1.14 57.75,39.77 59.18,38.35 63.76,38.35 68.99,43.57 68.99,54.48 75.23,60.72 75.23,65.38 77.18,67.33 U3.4
BURN2
  Top 0.254: U1.9 55.25,38.75 57.68,36.31 64.82,36.31 71.05,42.54 71.05,53.07 80.81,62.83 80.81,65.68 79.81,66.67 U3.5
BURN3
  Top 0.254: U3.6 79.81,66.02 80.35,65.48 80.35,62.97 70.64,53.27 70.64,42.8 64.57,36.72 58.06,36.72 55.75,39.03 U1.10
BURN4
  Top 0.254: U1.11 56.25,39.22 58.34,37.13 64.36,37.13 70.24,43 70.24,53.48 79.94,63.19 79.94,64.91 79.48,65.38 U3.7
D2  (via drill 0.3)
  Top 0.254: U$10.3 44.15,21.23 R1.2 v44.15,24.83 | U1.32 55.25,45.81 v54.51,46.54
  Bottom 0.254: v54.51,46.54 51.7,43.73 51.7,34.52 44.15,26.97 v44.15,24.83
D3  (via drill 0.3)
  Top 0.254: U$1.3 34.15,21.77 R23.2 35.86,25.71 v41.54,25.71 v41.55,25.72 | v52.3,45.16 52.48,44.98 53.09,44.98 53.32,44.75 U1.1
  Bottom 0.254: v52.3,45.16 50.83,43.69 50.83,34.79 41.76,25.72 v41.55,25.72
D4  (via drill 0.7)
  Top 0.254: U1.2 53.25,44.25 52.92,44.57 51.59,44.57 v49.88,46.28
D13  (via drill 0.3)
  Top 0.254: U1.17 60.75,41.25 61.22,40.79 | 61.22,40.79 61.29,40.71 65.5,40.71 68.37,43.58 v68.37,49.49 v68.38,49.5 | v71.63,52.76 71.82,52.76 81.43,62.37 81.43,67.97 80.12,69.28 U3.1 | 60.8,30 R14.2 | 61.22,40.79 61.22,40.5 v61.26,40.46 | v61.28,34.99 61.28,31.45 ISP1.3
  Top 0.61: ISP1.3 60.8,30
  Bottom 0.254: v71.63,52.76 v68.38,49.5 | v61.28,34.99 61.26,35.01 v61.26,40.46
  Bottom 0.61: ISP1.3 62.73,30.91
GND  (via drill 0.3, 0.35)
  Top 0.254: U1.5 56.91,42.75 v57.05,42.9 57.41,43.25 U1.21 61.43,43.25 62.04,43.86 62.04,44.28 62.43,44.67 63.78,44.67 C13.1
  Top 0.305: 72.92,28 72.95,28.03 | 39.24,41.82 39.24,36.99 44.37,31.85 44.37,29.69 | 44.37,29.69 44.37,29.5 45.48,28.4 S1.1 48.78,28.4 49.73,29.36 | C1.2 44.34,29.65 44.37,29.69 | L3.C 50.38,30 49.73,29.36 | 49.73,29.36 49.75,29.34 L4.C 49.75,23.77 48.84,22.87 48.33,22.87 U$10.2 49.75,17.71 L1.C 49.75,16.86 48.65,15.76 48.22,15.76 U$2.2 46.46,11.11 C30.1 44.15,12.2 39.26,12.2 U$3.2 39.31,15.85 39.7,15.85 40,16.15 L2.C 40,18.46 U$1.2 39.75,23.29 L5.C | 72.85,43 72.95,43.1
  Top 0.406: R7.2 11.65,76.95 v12,76.6 | D11.C D1.C 48.25,66.65 v47.4,67.5 | v44.9,69.9 44.1,70.7 44.1,71.5 C7.- | L9.C L8.C L7.C L6.C 93.41,59.66 v92.84,59.66 | U3.8 77.42,64.72 76.52,63.82 76.52,62.73 75.95,62.16 v75.95,62.1
  Top 0.508: v31.68,69.35 30.7,70.33 U6.1 | 19.9,59.62 19.46,59.19 J2.2 19.46,42.66 17.6,40.8 C5.2 14.99,35.39 6.39,35.39 U$8.10 2.5,20.44 8.28,14.66 25.6,14.66 28.35,11.91 C32.1 | 34.35,62.15 C2.2 28.35,59 C6.2 29.62,53.23 35.68,53.23 37.46,51.45 J1.2 37.46,43.6 39.24,41.82 41,41.82 | 34.35,62.15 35.8,62.15 C8.- | 34.35,62.15 34.33,62.17 v34.33,63.02 | C33.2 41,41.82 | 41,41.82 C31.2 | ISP1.6 72.91,27.46 72.95,27.42 | C4.2 72.85,15.4 72.95,15.3 | v67.26,36.65 68.91,35 C29.-
  Top 0.61: C32.1 28.35,4.69 U$11.2 29.04,3.52 30.86,1.7 46.6,1.7 | C30.1 45.85,4.69 U$12.2 46.54,1.76 46.6,1.7 | 63.6,14.5 64.5,15.4 C4.2 | 63.6,14.5 63.6,4.44 U$7.2 64.04,1.74 64,1.7 | C11.1 61.65,14.5 63.6,14.5 | C7.- 46.4,74 v46.4,77.4 | 19.46,59.56 19.4,59.62 | 46.6,1.7 64,1.7 | 64,1.7 72.9,1.7 | 72.9,1.7 88.8,1.7 98,10.9 U$5.P$1 | C18.- 72.95,43.1 C29.- 72.95,28.03 72.95,27.42 C14.- 72.95,15.3 C16.- 72.95,1.75 72.9,1.7
  Top 0.813: C3.2 42.45,73.15 C7.- | U6.1 28.18,73.15 C9.2 23.55,73.15 C10.- 16.1,71.6 J9.2 8.55,60.95 C12.- 18.32,59.62 19.4,59.62 19.9,59.62 U4.1
  Bottom 0.406: 14.75,76.35 14.5,76.6 v12,76.6 | v47.4,67.5 45,69.9 v44.9,69.9 | v92.84,59.66 92.55,59.37 92.23,59.37
  Bottom 0.508: v34.33,63.02 34.33,66.7 v31.68,69.35 | v57.05,42.9 62.48,42.9 67.26,38.11 v67.26,36.65
  Bottom 0.61: v46.4,77.4 v46.4,78.03 | U$9.2 U$13.2 U$14.2 U$15.2 69.54,62.36 69.8,62.1 | ISP1.6 65.27,28.44 65.29,28.46
  Bottom 1.8: U$5.P$1 97.2,12 95.1,14.1 95.1,25.98 | 95.1,25.98 95.1,39.97 | 95.1,39.97 95.1,54.11 | 95.1,54.11 95.1,56.5 92.23,59.37 89.5,62.1 v75.95,62.1 74.83,62.1 | J9.2 7.1,62.5 11.3,66.7 11.3,72.9 14.75,76.35 16.43,78.03 v46.4,78.03 51.06,78.03 67,62.1 69.8,62.1 74.91,62.1 | U$4.P$1 95.12,26 95.1,25.98 | U$21.P$1 95.13,40 95.1,39.97 | U$6.P$1 95.21,54 95.1,54.11
  other vias: 76.69,38.29 79.37,53.44 24.69,25.29 16.69,29.29 76.69,72.29 60.06,34.89 46.06,54.89
  pour Bottom (isolate 0.254): -1,77 arc-90 3,81 97,81 arc-90 101,77 101,3 arc-90 97,-1 3,-1 arc-90 -1,3
  pour Top (isolate 0.254): 101,77 arc90 97,81 3,81 arc90 -1,77 -1,3 arc90 3,-1 97,-1 arc90 101,3
N$1  (via drill 3.1)
  other vias: 97,77
N$2
  Top 0.406: R7.1 13.95,76.9 Q6.G
N$3  (via drill 3.1)
  other vias: 97,3
N$4  (via drill 3.1)
  other vias: 3,3
N$5  (via drill 0.3)
  Top 0.254: U1.18 61.21,41.75 v61.61,41.36 | v53.43,42.95 53.73,43.25 U1.4
  Bottom 0.406: JMP3.2 57,37.24 57.02,37.26 | 57.02,37.26 61.02,41.25 61.5,41.25 v61.61,41.36 | v53.43,42.95 53.43,40.98 57.02,37.38 57.02,37.26
N$6  (via drill 3.1)
  other vias: 3,77
N$7
  Top 0.406: D1.A R6.1
N$8
  Top 0.406: R12.1 D11.A
N$9  (via drill 0.3)
  Top 0.406: JMP6.2 19.82,25 v19.4,25.42 | v19.38,27.92 19.38,29.25 18.5,30.13 U$8.2
  Bottom 0.406: v19.4,25.42 19.4,27.89 v19.38,27.92
N$10
  Top 0.406: JMP7.2 16.32,25 15.62,25.7 15.62,30.62 U$8.3
N$11
  Top 0.61: C30.2 44.15,4.15 U$12.1
  Bottom 0.61: JMP9.2 U$12.1
N$12
  Top 0.254: R14.1 L3.A
N$13
  Top 1.016: U$4.P$2 91.9,28.54 | 91.9,28.54 86.04,28.54 Q3.3 | D2.A 91.9,28.93 91.9,28.54
N$14
  Top 0.406: R16.1 81.05,21.2 Q3.1 84.95,21.2 R15.1
N$15
  Top 1.016: Q4.3 92,14.5 | 92,14.5 97.96,14.5 U$5.P$2 | D6.A 92,14.5
N$16
  Top 0.406: R17.1 84.95,7.2 Q4.1 81.05,7.2 R18.1
N$17
  Top 1.016: Q5.3 86.53,57.02 D7.A 97.52,57.02 U$6.P$2
N$18
  Top 0.406: R19.1 84.95,49.2 Q5.1 81.05,49.2 R20.1
N$19
  Top 0.254: U1.8 50.4,41.25 48.74,39.59 Q2.2 45.5,39.09 41.44,39.09 C33.1
N$20
  Top 0.254: U1.7 50.51,41.75 47.85,44.41 Q2.1 45.48,44.93 41.42,44.93 C31.1
N$21
  Top 0.254: R21.1 L1.A
N$22
  Top 0.254: R22.1 L2.A
N$23
  Top 0.254: R23.1 L5.A
N$24
  Top 0.406: L6.A R24.1
N$25
  Top 0.406: L7.A R25.1
N$26
  Top 0.406: L8.A R26.1
N$27
  Top 0.406: L9.A R27.1
N$28
  Top 0.61: C11.2 U$7.1
  Bottom 0.61: JMP10.2 U$7.1
N$29  (via drill 0.3)
  Top 0.406: v22.01,53.94 22,53.93 J2.1 22,48.37 v23.81,46.56
  Bottom 0.406: v22.01,53.94 JMP5.2 | J1.1 36.06,46.56 v23.81,46.56
N$30  (via drill 0.3)
  Top 0.406: J2.3 16.92,48.68 v17.94,47.66
  Bottom 0.406: JMP1.2 35,50.58 J1.3 32.08,47.66 v17.94,47.66
N$31  (via drill 0.3)
  Top 0.406: J2.4 14.38,53.52 v14.41,53.55
  Bottom 0.406: v14.41,53.55 14.41,54.41 JMP2.2 | J2.4 14.38,49.86 15.66,48.58 30.45,48.58 J1.4
N$32
  Top 0.254: C13.2 62,42.75 U1.20
N$33
  Top 0.254: R1.1 L4.A
N$49
  Top 0.61: U$11.1 26.5,10.35 C32.2
  Bottom 0.61: JMP8.2 U$11.1
N$59
  Top 0.152: D5.A 11.58,74.07 Q6.D
  Top 2: J9.1 7,69.55 Q6.D
N$71
  Top 0.406: U3.15 84.91,68.62 85.42,69.14 85.42,73.04 U$20.P$2
N$72
  Top 0.406: U3.14 85.23,67.97 88,70.75 U$22.P$2
N$76
  Top 0.152: U$19.- 59.44,69.49 59.25,69.49
  Top 0.406: D3.A 57.15,66.25 59.25,68.35 59.25,69.49 LS1.- 61.02,74.77 67.72,74.77 68.27,75.31 68.27,76.78 69.46,77.98 74.38,77.98 83.08,69.28 U3.16
N$77
  Top 0.152: 52.7,69.34 52.58,69.34 U$19.+
  Top 0.406: U$19.+ 52.7,69.7 52.7,72.95 LS1.+ | R40.1 54.85,63.8 D3.C 52.7,67.65 52.7,69.34 52.7,69.5
N$78
  Top 1.016: Q1.3 91.47,42.5 91.52,42.54 | 91.52,42.54 D4.A | U$21.P$2 91.52,42.54
N$79
  Top 0.406: R41.1 84.95,35.2 Q1.1 81.05,35.2 R42.1
RST  (via drill 0.3)
  Top 0.254: 60.96,27.46 57.77,27.46 56.01,29.22 56.01,30.92 54.26,32.66 v52.5,32.66 46.56,32.66 S1.2 46.24,32.6 v45.82,32.18 | U1.29 v56.75,47.95 v56.75,47.96 | R3.1 C1.1 43.5,31.35 v43.54,31.39
  Top 0.61: ISP1.5 60.96,27.46
  Bottom 0.254: v52.5,32.66 52.5,43.7 v56.75,47.96 | v43.54,31.39 45.03,31.39 v45.82,32.18
  Bottom 0.61: ISP1.5 63.63,27.46 63.63,27.45
RX  (via drill 0.3)
  Top 0.254: 33.12,3 32.67,2.55 31.24,2.55 30.28,3.51 30.28,20.25 27.23,23.3 JMP6.3 v20.99,23.3 JMP7.1 | U1.30 56.25,47.11 55.59,47.76 49.68,47.76 49.69,47.77 49.39,47.77 v49.35,47.73
  Top 0.61: U$11.4 33.12,3
  Bottom 0.254: v49.35,47.73 49.33,47.7 45.4,47.7 JMP6.3 v20.99,23.3
  Bottom 0.61: U$11.4 34.12,5.05 34.11,5.05
RX1  (via drill 0.3)
  Top 0.254: U1.16 58.75,40.05 59.25,39.55 v61.92,39.55 v61.93,39.55 | 62.64,33.35 v62.64,35.16 | 49.08,5.52 49.08,8.32 61.35,20.59 v61.35,24.35
  Top 0.61: U$12.3 49.08,5.52 | ISP1.1 62.64,32.63 62.64,33.35
  Bottom 0.254: v61.93,39.55 62.64,38.84 v62.64,35.16 | 62.26,32.07 61.35,31.16 v61.35,24.35
  Bottom 0.61: U$12.3 49.08,5.48 49.09,5.49 | ISP1.1 62.26,32.07
SCL0  (via drill 0.3)
  Top 0.254: v57.33,47.39 57.25,47.31 U1.28
  Top 0.61: U$7.3 66.58,4.72 67.44,5.58
  Bottom 0.254: JMP1.3 39.07,52.13 53.5,52.13 57.34,48.29 57.34,47.72 57.33,47.71 v57.33,47.39 63.48,47.39 68.43,42.44 68.43,6.53 67.46,5.55
  Bottom 0.61: U$7.3 66.58,4.68 67.46,5.55
SCL1  (via drill 0.3)
  Top 0.254: U1.6 51.38,42.25 40.45,53.18 v40.39,53.18
  Bottom 0.254: v40.39,53.18 37.88,55.7 34.12,55.7 33.3,54.88 JMP1.1
SDA0  (via drill 0.3)
  Top 0.254: U1.27 57.75,46.94 58.19,47.38 v58.19,48.05
  Top 0.61: U$7.4 69.12,5.52
  Bottom 0.254: 58.17,48.07 58.17,48.13 50.12,56.19 29.68,56.19 26.5,53.01 17.69,53.01 JMP2.3 | 58.17,48.07 58.17,48.06 v58.19,48.05 | 69.12,5.61 69.12,42.65 63.7,48.07 58.17,48.07
  Bottom 0.61: U$7.4 69.12,5.61
SDA1  (via drill 0.3)
  Top 0.254: U1.3 53.17,43.75 52.76,44.17 50.04,44.17 40.98,53.23 40.98,53.43 40.33,54.07 v31.68,54.07
  Bottom 0.254: v31.68,54.07 30.11,52.51 14.01,52.51 12.8,53.72 JMP2.1
TX  (via drill 0.3)
  Top 0.254: JMP7.3 v20.96,26.7 JMP6.1 25.48,26.7 31.58,20.6 31.58,5.3 | U1.31 55.75,46.24 54.85,47.14 50.98,47.14 v50.97,47.16
  Top 0.61: U$11.3 31.58,5.3
  Bottom 0.254: v50.97,47.16 49.79,48.33 42.6,48.33 v20.96,26.7
  Bottom 0.61: U$11.3 31.58,5.11 31.57,5.12
TX1  (via drill 0.3)
  Top 0.254: U1.15 58.25,39.85 59.16,38.94 v63.23,38.94 | v63.82,35.12 64,34.94 64,30.02 64.02,30 | 64.02,30 64.16,30 | 51.62,5.45 51.62,9.53 64,21.91 64,30 64.02,30
  Top 0.61: U$12.4 51.62,5.45 | ISP1.4 64.16,30
  Bottom 0.254: v63.23,38.94 63.82,38.35 v63.82,35.12
  Bottom 0.61: U$12.4 51.62,5.35 51.62,5.36 | ISP1.4 64.19,30 64.18,30.02
UL2  (via drill 0.3)
  Top 0.254: U1.12 56.75,39.44 58.66,37.53 64.17,37.53 69.83,43.2 69.83,53.66 79.28,63.11 v79.28,63.68 | v80.55,67.03 v80.56,67.04 80.56,67.81 79.74,68.62 U3.2
  Bottom 0.254: v79.28,63.68 79.28,64.11 80.55,65.37 v80.55,67.03
UL3  (via drill 0.3)
  Top 0.254: U3.3 78.15,67.99 79.28,67.99 79.74,67.53 v79.74,67.39 | U1.13 57.25,39.66 58.97,37.94 63.94,37.94 69.4,43.4 69.4,53.81 78.45,62.86 v78.45,63.69
  Bottom 0.254: v78.45,63.69 78.45,64.21 79.75,65.5 v79.75,67.39 v79.74,67.39
VCC  (via drill 0.3, 0.35)
  Top 0.152: v18.27,63.61 18.29,63.55 18.29,63.6
  Top 0.406: R6.2 42.05,65.1 v42,65.1 | v37.5,69.7 36.6,70.6
  Top 0.61: C4.1 66,10 v65.1,9.1 | U4.3 27.3,56.26 26.65,55.61 C6.1
  Top 0.813: U6.4 38,77.38 | 38,77.38 43.02,77.38 C7.+ | 38,77.38 C3.1 37.35,74.85 36.6,74.1 36.6,70.6 36.6,69.4 35.4,68.2 32.9,68.2 | U6.2 32.9,70.53 32.9,68.2 | 32.9,68.2 19.35,68.2 17,65.85 C12.+ 17,64.25 17.65,63.6 18.29,63.6 v19.16,63.6 23.8,63.6 27.3,60.1 U4.3
  Bottom 0.305: U$1.1 41.69,19.31 47.41,19.31 49,20.9 U$10.1
  Bottom 0.406: v42,65.1 37.5,69.6 v37.5,69.7 | v65.1,9.1 53.3,20.9 | 53.3,20.9 49,20.9 | 53.3,20.9 53.3,28.91 55.3,30.91 JMP3.3
  Bottom 0.508: 63.5,7.3 63.5,5.64 62.78,4.92 62.78,3.08 62.5,2.8 | JMP9.3 45.7,6.04 45.28,5.62 45.28,2.38 45.2,2.3 | JMP8.3 27.77,6.57 27.77,2.76 26.8,1.79 24.8,1.79 22.9,3.69 22.9,11.07 20.95,13.02 11.46,13.02 0.81,23.66 0.81,53.6 10.81,63.6 v19.16,63.6
  Bottom 0.61: v65.1,9.1 65.1,8.9 63.5,7.3 JMP10.3 | JMP8.3 38.69,7 43.39,2.3 45.2,2.3 62,2.3 62.5,2.8 | JMP5.3 C6.1
  other vias: 26.65,54.5
VIN  (via drill 0.35)
  Top 0.152: v18.52,75.4 18.59,75.44 18.59,75.4 | v19.43,75.4 19.51,75.44 19.51,75.4 | v92,10 92.05,10.06 92,10.06 | v92,11 92.05,10.97 D6.C | v92,22.4 92.05,22.4 v92,22.4 | v92,23.3 92.05,23.32 92,23.32 | v92,37.1 92.05,37.03 92,37.03 | v92,38 92.05,37.95 92,37.95 | v92,51.5 92.05,51.51 92,51.51 | v92,52.4 92.05,52.43 D7.C
  Top 0.406: R40.2 58.7,63.5 v58.8,63.4 | v81.7,59.39 81.73,59.39 85.71,63.38 85.71,64.46 85.82,64.57 85.67,64.72 U3.9 83.88,64.73 85.65,64.73 v85.8,64.59 | U$22.P$1 U$20.P$1
  Top 0.813: D5.C 15.43,74.1 14.35,74.1 Q6.S 14.35,73.3 14.9,73.3 | C10.+ 22,74.85 C9.1 32.45,74.85 35.3,72 U6.3 | C16.+ 77.05,8.7 80.25,5.5 85.85,5.5 86.85,6.5 R17.2 | R15.2 86.85,20.38 86.32,19.84 78.81,19.84 77.65,21 C14.+ | R41.2 86.85,34.38 86.32,33.84 78.81,33.84 77.65,35 C29.+ | R19.2 86.85,48.38 86.32,47.84 78.81,47.84 77.65,49 C18.+
  Top 1.016: R17.2 88.08,7 Q4.2 90.1,7.2 v92,9.1 | v92,21.5 91.7,21.2 Q3.2 88.08,21 R15.2 | R41.2 88.08,35 Q1.2 90.9,35.2 91.9,36.2 v92,36.2 | R19.2 88.08,49 Q5.2 90.5,49.2 91.9,50.6 v92,50.6
  Top 2: D5.C 15.72,73.8 16.02,73.8 v17.62,75.4 v18.52,75.4 18.59,75.4 v19.43,75.4 19.51,75.4 21.2,75.4 22,76.2 C10.+ | D7.C v92,52.4 92,51.51 v92,51.5 v92,50.6 | D4.C v92,38 92,37.95 v92,37.1 92,37.03 v92,36.2 | D2.C 92,23.32 v92,23.3 v92,22.4 v92,21.5 | D6.C 92,10.06 v92,10 v92,9.1
  Bottom 0.152: 20.42,75.4 20.42,75.44 v20.32,75.4
  Bottom 0.406: U$22.P$1 86.45,75.45 86.45,68.9 87.42,67.94 87.42,66.21 v85.8,64.59
  Bottom 2: v17.62,75.4 v20.32,75.4 20.42,75.4 46.8,75.4 v58.8,63.4 62.81,59.39 v81.7,59.39 88.01,59.39 92,55.4 v92,50.6 v92,36.2 v92,21.5 v92,9.1

### Text on the board
Top: roninsrobotics.com | @by1ronin
tPlace: + | A0 | A1 | - | 8 | 9 | A6 | 1 | + | A7 | 2 | D13 | 3V3 | GND | S | 3 | 5V | 4 | - | 3V3 | + | Brn4 | Nimbus-21 | - | 4 | + | Brn1 | - | 10 | 3V3 | D13 | GND | + | TX | RST | Brn2 | - | 5 | RX | D3 | GND | 5V | D2 | GND | 5V | + | Brn3 | A3 | GND | 3V3 | A2 | GND | 3V3 | - | 6 | V | GND | TX0 | RX0 | V | GND | RX1 | TX1 | V | GND | SCL0 | SDA0
bPlace: i1 | i0 | 3 | 5 | i1 | i0 | MARMARA | DYNAMICS | 5 | 3 | Nimbus-21 | 3 | 5 | 3 | 5 | 3 | 5